# EAGLE design Nest (EAGLE 6.4)
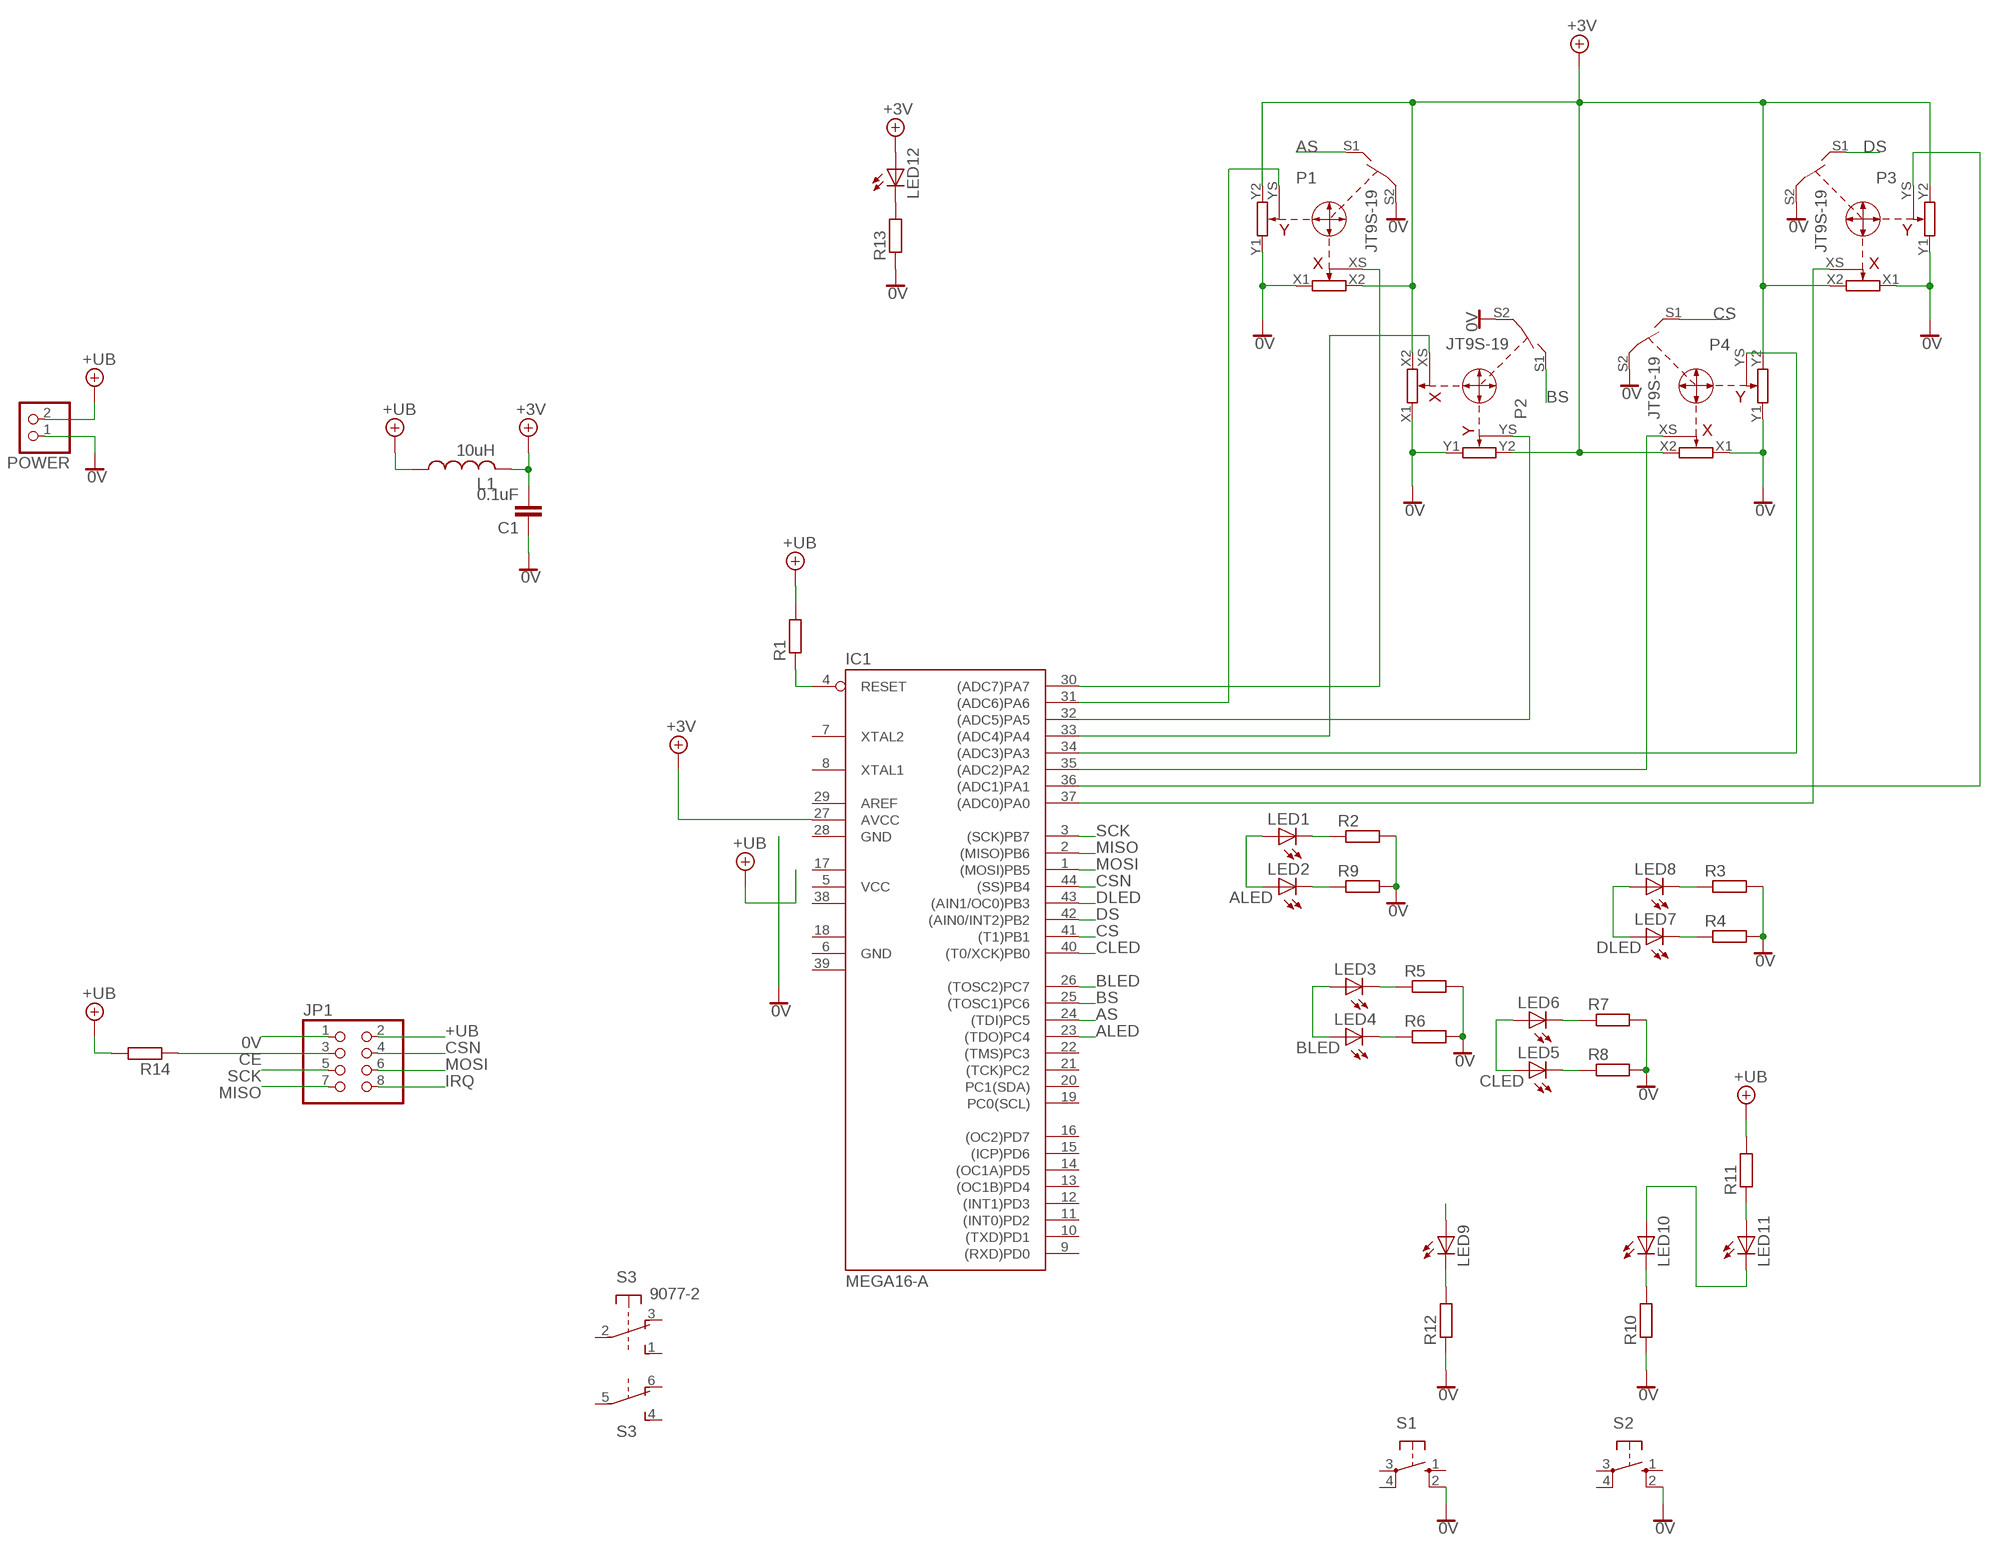
[diagram p0: schematic, sheet 1]

## Parts
C1  0.1uF  C-EU050-024X044  [C050-024X044]
IC1  MEGA16-A  [TQFP44]
JP1  PINHD-2X4  [2X04]
L1  10uH  L-US0204/7  [0204/7]
LED1  LED3MM  [LED3MM]
LED2  LED3MM  [LED3MM]
LED3  LED3MM  [LED3MM]
LED4  LED3MM  [LED3MM]
LED5  LED3MM  [LED3MM]
LED6  LED3MM  [LED3MM]
LED7  LED3MM  [LED3MM]
LED8  LED3MM  [LED3MM]
LED9  LED3MM  [LED3MM]
LED10  LED3MM  [LED3MM]
LED11  LED3MM  [LED3MM]
LED12  LED3MM  [LED3MM]
P1  JT9S-19  [JT9S-1P]
P2  JT9S-19  [JT9S-1P]
P3  JT9S-19  [JT9S-1P]
P4  JT9S-19  [JT9S-1P]
POWER  PINHD-1X2  [1X02]
R1  R-EU_R1206  [R1206]
R2  R-EU_M0805  [M0805]
R3  R-EU_M0805  [M0805]
R4  R-EU_M0805  [M0805]
R5  R-EU_M0805  [M0805]
R6  R-EU_M0805  [M0805]
R7  R-EU_M0805  [M0805]
R8  R-EU_M0805  [M0805]
R9  R-EU_M0805  [M0805]
R10  R-EU_M0805  [M0805]
R11  R-EU_M0805  [M0805]
R12  R-EU_M0805  [M0805]
R13  R-EU_M0805  [M0805]
R14  R-EU_R1206  [R1206]
S1  10-XX  [B3F-10XX]
S2  10-XX  [B3F-10XX]
S3  9077-2  [9077-2]

## Nets
0V: C1.1 JP1.1 P1.S2 P1.X1 P1.Y1 P2.S2 P2.X1 P2.Y1 P3.S2 P3.X1 P3.Y1 P4.S2 P4.X1 P4.Y1 POWER.1 R2.2 R3.2 R4.2 R5.2 R6.2 R7.2 R8.2 R9.2 R10.1 R12.1 R13.1 S1.2(S1) S2.2(S1)
+4.1V: C1.2 IC1.27(AVCC) L1.2 LED12.A P1.X2 P1.Y2 P2.X2 P2.Y2 P3.X2 P3.Y2 P4.X2 P4.Y2 ; supply symbol labelled +3V
+UB: JP1.2 L1.1 POWER.2 R1.2 R11.2 R14.2
ALED: IC1.23((TDO)PC4) LED1.A LED2.A
AS: IC1.24((TDI)PC5) P1.S1
BLED: IC1.26((TOSC2)PC7) LED3.A LED4.A
BS: IC1.25((TOSC1)PC6) P2.S1
CE: JP1.3 R14.1
CLED: IC1.40((T0/XCK)PB0) LED5.A LED6.A
CS: IC1.41((T1)PB1) P4.S1
CSN: IC1.44((SS)PB4) JP1.4
DLED: IC1.43((AIN1/OC0)PB3) LED7.A LED8.A
DS: IC1.42((AIN0/INT2)PB2) P3.S1
IRQ: JP1.8
MISO: IC1.2((MISO)PB6) JP1.7
MOSI: IC1.1((MOSI)PB5) JP1.6
N$1: LED1.K(C) R2.1
N$2: LED7.K(C) R4.1
N$3: IC1.4(RESET) R1.1
N$4: IC1.37((ADC0)PA0) P3.XS
N$6: IC1.31((ADC6)PA6) P1.YS
N$7: IC1.32((ADC5)PA5) P2.YS
N$8: IC1.33((ADC4)PA4) P2.XS
N$9: IC1.34((ADC3)PA3) P4.YS
N$10: IC1.35((ADC2)PA2) P4.XS
N$11: LED8.K(C) R3.1
N$12: IC1.36((ADC1)PA1) P3.YS
N$13: LED4.K(C) R6.1
N$14: LED3.K(C) R5.1
N$15: LED6.K(C) R7.1
N$16: LED5.K(C) R8.1
N$17: LED2.K(C) R9.1
N$22: LED10.A LED11.K(C)
N$23: LED11.A R11.1
N$24: LED10.K(C) R10.2
N$25: LED9.K(C) R12.2
N$26: LED12.K(C) R13.2
N$42: IC1.30((ADC7)PA7) P1.XS
N$58: LED9.A
SCK: IC1.3((SCK)PB7) JP1.5
Unconnected: IC1.7(XTAL2) IC1.8(XTAL1) IC1.9((RXD)PD0) IC1.10((TXD)PD1) IC1.11((INT0)PD2) IC1.12((INT1)PD3) IC1.13((OC1B)PD4) IC1.14((OC1A)PD5) IC1.15((ICP)PD6) IC1.16((OC2)PD7) IC1.19(PC0(SCL)) IC1.20(PC1(SDA)) IC1.21((TCK)PC2) IC1.22((TMS)PC3) IC1.29(AREF) S1.1(S) S1.3(P) S1.4(P1) S2.1(S) S2.3(P) S2.4(P1) S3.1(1:S) S3.2(1:P) S3.3(1:O) S3.4(2:S) S3.5(2:P) S3.6(2:O)

## Power pins joined to a net without a drawn wire
GND: IC1.6(GND) IC1.28(GND)
GND1: IC1.18(GND1)
GND2: IC1.39(GND2)
VCC: IC1.5(VCC)
VCC1: IC1.17(VCC1)
VCC2: IC1.38(VCC2)

## Library data of the parts
C1 = rcl:C-EU: CAPACITOR, European symbol
IC1 = atmel:MEGA16: MICROCONTROLLER 16 Kbytes FLASH 1 kbytes SRAM 512 bytes EEPROM USART 8-channel 10 bit ADC Source: avr.lbr; MPN: ATMEGA16-16AU; OC_FARNELL: 9171134; OC_NEWARK: 96K6515
JP1 = pinhead:PINHD-2X4: PIN HEADER
L1 = rcl:L-US: INDUCTOR, American symbol
LED1-LED12 = led:LED: LED OSRAM: - CHIPLED LG R971, LG N971, LY N971, LG Q971, LY Q971, LO R971, LY R971 LH N974, LH R974 LS Q976, LO Q976, LY Q976 LO Q996 - Hyper CHIPLED LW Q18S LB Q993, LB Q99A, LB R99A - SideLED LS A670, LO A670, LY A670, LG A670, LP A670 LB A673, LV A673, LT A673, LW A673 LH A674 LY A675 LS A676, LA A676, LO A676, LY A676, LW A676 LS A679, LY A679, LG A679 - Hyper Micro SIDELED® LS Y876, LA Y876, LO Y876, LY Y876 LT Y87S - SmartLED LW L88C, LW L88S LB L89C, LB L89S, LG L890 LS L89K, LO L89K, LY L89K LS L896, LA L896, LO L896, LY L896 - TOPLED LS T670, LO T670, LY T670, LG T670, LP T670 LSG T670, LSP T670, LSY T670, LOP T670, LYG T670 LG T671, LOG T671, LSG T671 LB T673, LV T673, LT T673, LW T673 LH T674 LS T676, LA T676, LO T676, LY T676, LB T676, LH T676, LSB T676, LW T676 LB T67C, LV T67C, LT T67C, LS T67K, LO T67K, LY T67K, LW E67C LS E67B, LA E67B, LO E67B, LY E67B, LB E67C, LV E67C, LT E67C LW T67C LS T679, LY T679, LG T679 LS T770, LO T770, LY T770, LG T770, LP T770 LB T773, LV T773, LT T773, LW T773 LH T774 LS E675, LA E675, LY E675, LS T675 LS T776, LA T776, LO T776, LY T776, LB T776 LHGB T686 LT T68C, LB T68C - Hyper Mini TOPLED® LB M676 - Mini TOPLED Santana® LG M470 LS M47K, LO M47K, LY M47K Source: http://www.osram.convergy.de LUXEON: - LUMILED® LXK2-PW12-R00, LXK2-PW12-S00, LXK2-PW14-U00, LXK2-PW14-V00 LXK2-PM12-R00, LXK2-PM12-S00, LXK2-PM14-U00 LXK2-PE12-Q00, LXK2-PE12-R00, LXK2-PE12-S00, LXK2-PE14-T00, LXK2-PE14-U00 LXK2-PB12-K00, LXK2-PB12-L00, LXK2-PB12-M00, LXK2-PB14-N00, LXK2-PB14-P00, LXK2-PB14-Q00 LXK2-PR12-L00, LXK2-PR12-M00, LXK2-PR14-Q00, LXK2-PR14-R00 LXK2-PD12-Q00, LXK2-PD12-R00, LXK2-PD12-S00 LXK2-PH12-R00, LXK2-PH12-S00 LXK2-PL12-P00, LXK2-PL12-Q00, LXK2-PL12-R00 Source: www.luxeon.com KINGBRIGHT: KA-3528ASYC Source: www.kingbright.com
P1-P4 = jt9s-1p:JT9S-19: Joystick Potentiometer 10k
POWER = pinhead:PINHD-1X2: PIN HEADER
R1-R14 = rcl:R-EU_: RESISTOR, European symbol
S1 S2 = switch-omron:10-XX: OMRON SWITCH; MPN: B3F-1000; OC_FARNELL: 176432; OC_NEWARK: 36M3542
S3 = switch-misc:9077-2: MARQUARDT SWITCH 9077.0200 Distributor: Buerklin <https://www.buerklin.com/default.asp?event=ShowArtikel%2812G2822%29&l=d&jump=ArtNr_12G2822>

## Board
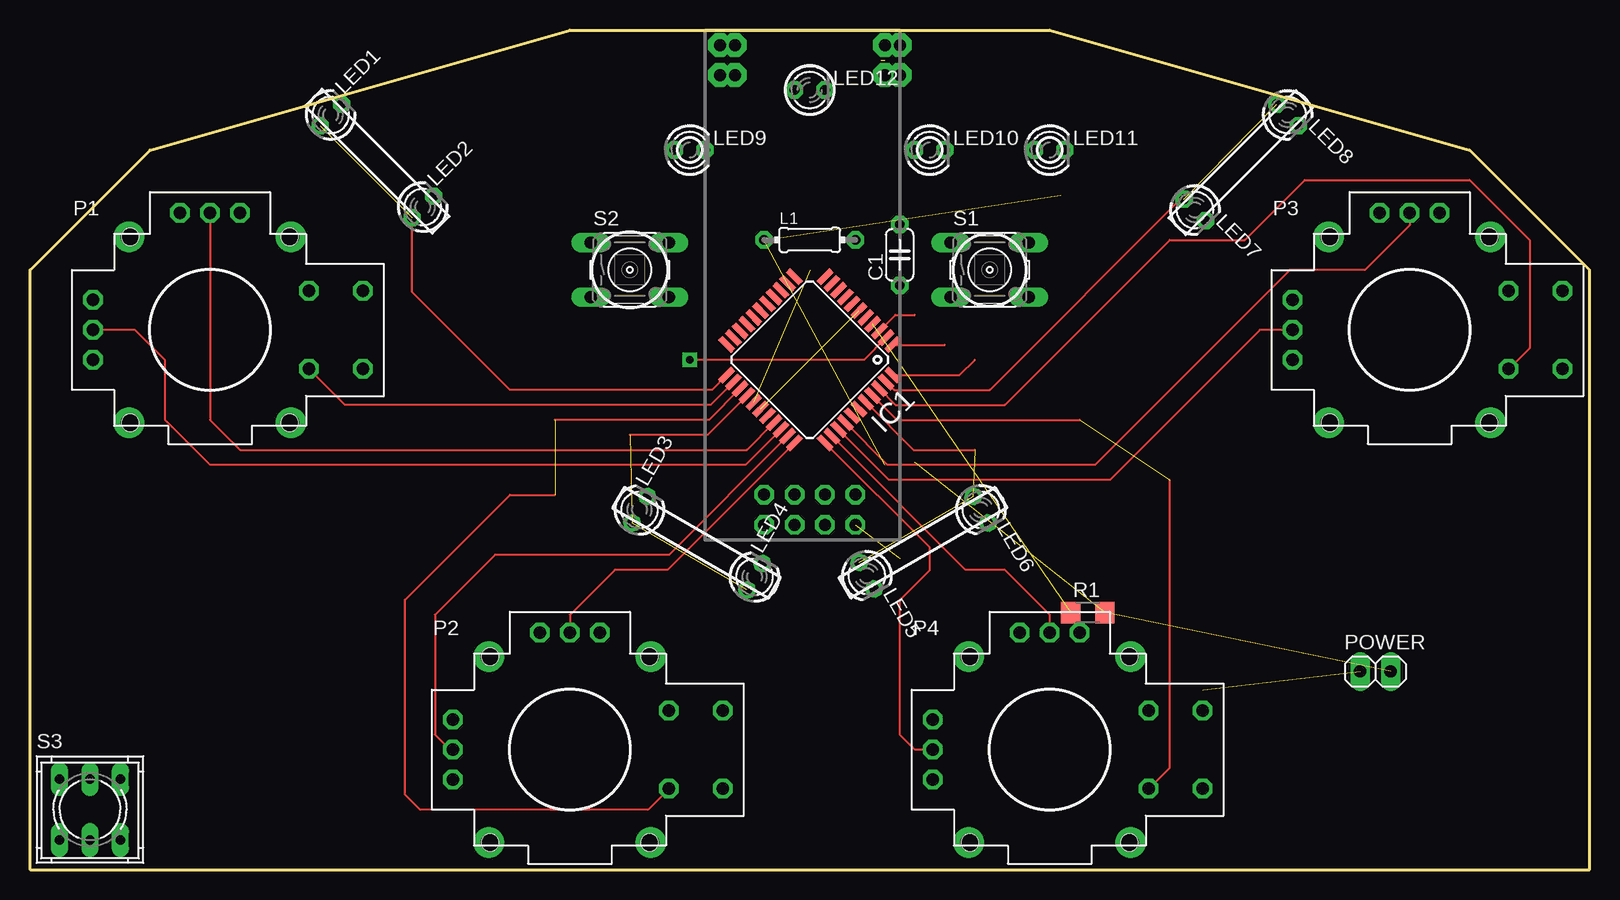
[diagram p1: board, top side]
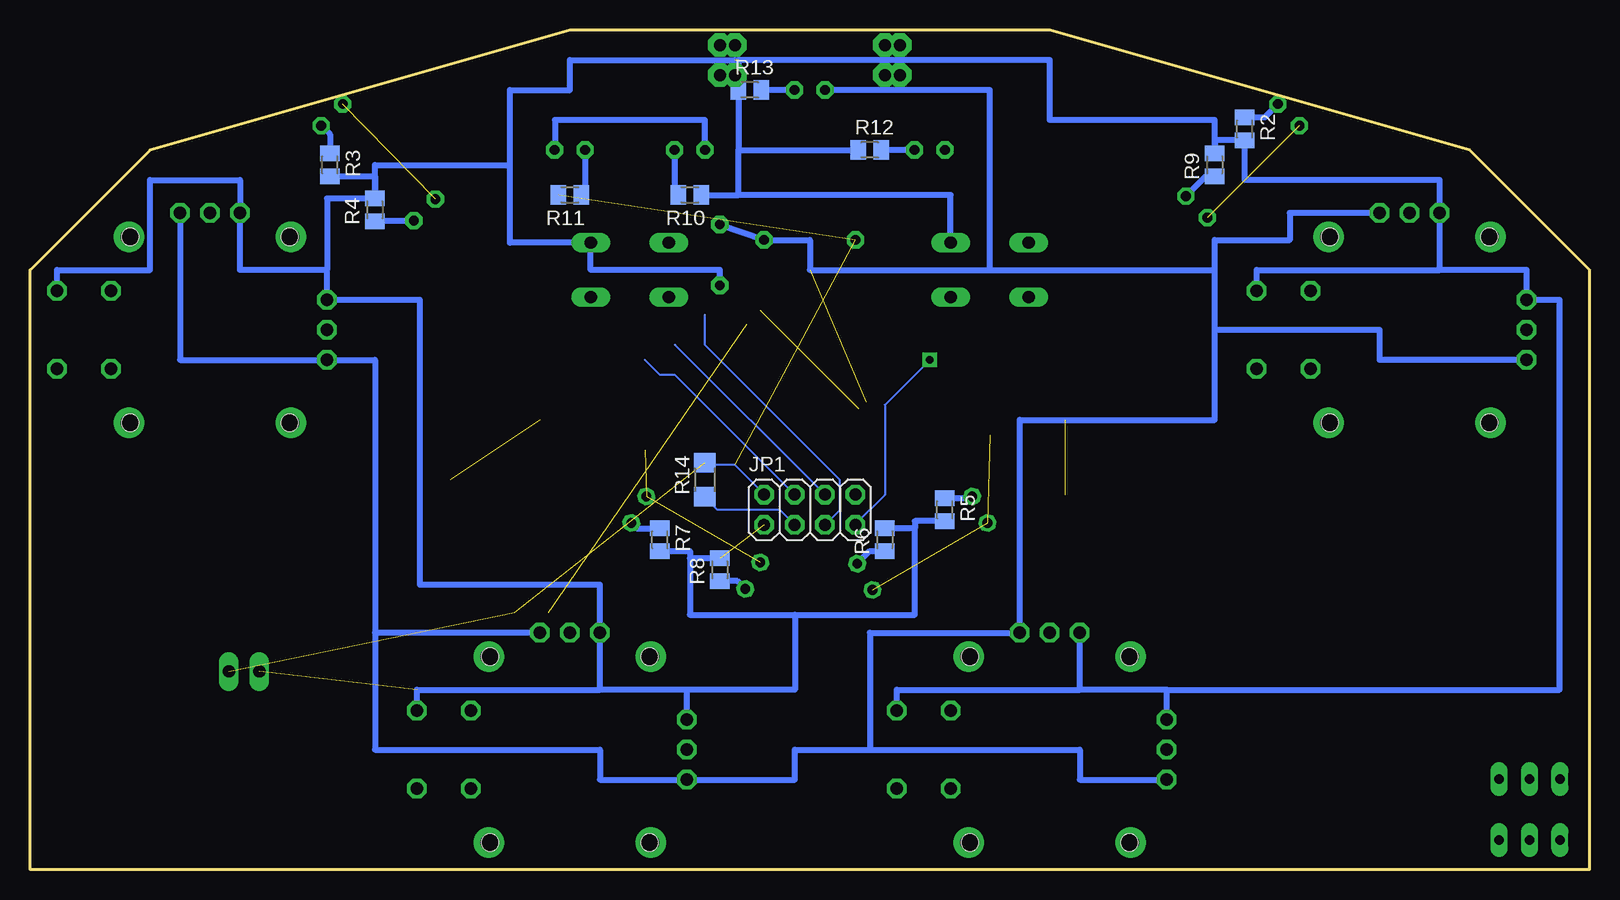
[diagram p2: board, bottom side, seen from below]

Size 130 x 70 mm. Coordinates in mm from the lower left corner, seen from the top.
Outline: 0,0 130,0 130,50 120,60 85,70 45,70 10,60 0,50 0,0
Copper layers (1*16): Top 0.035mm / dielectric 1.5mm / Bottom 0.035mm
Design rules "default": minimum track width 12mil, minimum drill 20mil, track to track 12mil, track to pad 12mil, pad to pad 12mil, via to via 12mil, smd to smd 12mil, copper to edge 40mil, drill to drill 40mil, minimum pad ring 12mil, minimum via ring 12mil, stop-mask expansion 8mil, vias tented up to drill 0mil, thermal gap 10mil

### Footprints (pad centres in the part's own frame; a part is rotated, then mirrored left to right if it is on the bottom)
C050-024X044 = drill 0.813 octagon: 1 -2.54,0; 2 2.54,0
TQFP44 = smd 1.5 x 0.5: 1 -5.8,4; 2 -5.8,3.2; 3 -5.8,2.4; 4 -5.8,1.6; 5 -5.8,0.8; 6 -5.8,0; 7 -5.8,-0.8; 8 -5.8,-1.6; 9 -5.8,-2.4; 10 -5.8,-3.2; 11 -5.8,-4; 23 5.8,-4; 24 5.8,-3.2; 25 5.8,-2.4; 26 5.8,-1.6; 27 5.8,-0.8; 28 5.8,0; 29 5.8,0.8; 30 5.8,1.6; 31 5.8,2.4; 32 5.8,3.2; 33 5.8,4 | smd 0.5 x 1.5: 12 -4,-5.8; 13 -3.2,-5.8; 14 -2.4,-5.8; 15 -1.6,-5.8; 16 -0.8,-5.8; 17 0,-5.8; 18 0.8,-5.8; 19 1.6,-5.8; 20 2.4,-5.8; 21 3.2,-5.8; 22 4,-5.8; 34 4,5.8; 35 3.2,5.8; 36 2.4,5.8; 37 1.6,5.8; 38 0.8,5.8; 39 0,5.8; 40 -0.8,5.8; 41 -1.6,5.8; 42 -2.4,5.8; 43 -3.2,5.8; 44 -4,5.8
2X04 = drill 1.016 octagon: 1 -3.81,-1.27; 2 -3.81,1.27; 3 -1.27,-1.27; 4 -1.27,1.27; 5 1.27,-1.27; 6 1.27,1.27; 7 3.81,-1.27; 8 3.81,1.27
0204/7 = drill 0.813 octagon: 1 -3.81,0; 2 3.81,0
LED3MM = drill 0.813 octagon: A -1.27,0; K 1.27,0
JT9S-1P = drill 1.016 octagon: S1 8.25,-3.25; S2 12.75,3.25; S3 12.75,-3.25; S4 8.25,3.25; X1 -2.5,9.75; X2 2.5,9.75; XS 0,9.75; Y1 -9.75,2.5; Y2 -9.75,-2.5; YS -9.75,0 | hole 1.422: -6.65,7.75; 6.65,7.75; 6.65,-7.75; -6.65,-7.75
1X02 = drill 1.016 long: 1 -1.27,0; 2 1.27,0
R1206 = smd 1.6 x 1.803: 1 -1.422,0; 2 1.422,0
M0805 = smd 1.3 x 1.6: 1 -0.95,0; 2 0.95,0
B3F-10XX = drill 1.016 long: 1 -3.251,2.261; 2 3.251,2.261; 3 -3.251,-2.261; 4 3.251,-2.261
9077-2 = drill 0.813 long: 1 -2.54,2.54; 2 0,2.54; 3 2.54,2.54; 4 -2.54,-2.54; 5 0,-2.54; 6 2.54,-2.54

### Placement (x,y rotation side)
C1  72.5,51.25 90 top
IC1  65,42.5 225 top
JP1  65,30 0 bottom
L1  65,52.5 0 top
LED1  25.07,62.93 45 top
LED2  32.75,55.25 45 top
LED3  50.82,30 60 top
LED4  60.41,24.41 60 top
LED5  69.75,24.5 300 top
LED6  79.25,30 300 top
LED7  97.1,55 315 top
LED8  104.82,62.93 315 top
LED9  55,60 0 top
LED10  75,60 0 top
LED11  85,60 0 top
LED12  65,65 0 top
P1  15,45 0 top
P2  45,10 0 top
P3  115,45 0 top
P4  85,10 0 top
POWER  112.15,16.51 0 top
R1  88.18,21.43 0 top
R2  28.75,61.75 270 bottom
R3  105,58.75 270 bottom
R4  101.25,55 90 bottom
R5  53.75,30 270 bottom
R6  58.75,27.5 90 bottom
R7  77.5,27.5 270 bottom
R8  72.5,25 90 bottom
R9  31.25,58.75 90 bottom
R10  75,56.25 180 bottom
R11  85,56.25 180 bottom
R12  60,60 0 bottom
R13  70,65 0 bottom
R14  73.75,32.5 90 bottom
S1  80,50 0 top
S2  50,50 0 top
S3  5,5 0 top

### Tracks (layer width: path | path; a pad name or v marks a point on that pad's centre or on a via)
0V  (3 unrouted)
  Bottom 0.5: P2.S2 57.75,15 42.5,15 | 42.5,15 P2.X1 | P2.Y1 35.25,15 | 35.25,15 42.5,15 | P4.Y1 75.25,15 | 75.25,15 82.5,15 | 82.5,15 P4.X1 82.5,23.75 97.5,23.75 97.5,47.5 P3.Y1 105.25,50 | P4.S2 97.75,15 82.5,15 | P1.S2 27.75,50 12.5,50 | 12.5,50 P1.X1 12.5,57.5 28.75,57.5 R2.2 31.25,60.8 R9.2 31.25,62.5 45,62.5 45,67.5 70.95,67.5 R13.1 70.95,60 | 12.5,50 5.25,50 P1.Y1 2.5,47.5 2.5,15 35.25,15 | 105.25,50 112.5,50 P3.X1 112.5,57.5 120,57.5 120,50 127.75,50 P3.S2 | 70.95,60 R12.1 | R10.1 70.95,56.25 | 70.95,56.25 70.95,60 | R3.2 101.25,57.8 R4.2 | R4.2 101.25,58.75 90,58.75 | 90,58.75 90,65 85,65 85,67.5 71.25,67.5 | R4.2 105.25,55.95 105.25,50 | S2.2 53.25,56.25 70.95,56.25 | 90,58.75 90,52.26 S1.2 83.25,50 72.5,50 C1.1 | R5.2 56.25,29.05 56.25,28.45 | 56.25,28.45 R6.2 | R8.2 75,25.95 | 75,25.95 75,21.25 66.25,21.25 | 66.25,21.25 56.25,21.25 56.25,28.45 | R7.2 75,26.55 75,25.95 | 66.25,21.25 66.25,15 75.25,15
+4.1V  (1 unrouted)
  Bottom 0.5: C1.2 68.81,52.54 L1.2 65,52.5 65,50 50,50 | 50,50 50,65 LED12.A | P1.Y2 17.5,42.5 17.5,45 31.25,45 | 31.25,45 31.25,50 | 31.25,50 31.25,52.5 25,52.5 25,54.75 P1.X2 | 50,50 31.25,50 | P3.X2 117.5,42.5 P3.Y2 101.25,42.5 101.25,19.75 | P4.X2 101.25,19.75 | 101.25,19.75 101.25,10 82.5,10 82.5,7.5 P4.Y2 66.25,7.5 66.25,10 60,10 | 60,10 60,19.75 P2.X2 47.5,37.5 31.25,37.5 31.25,45 | 60,10 42.5,10 42.5,7.5 P2.Y2
+UB  (4 unrouted)
  Bottom 0.15: JP1.2 68.81,31.31 71.25,33.75 73.58,33.75 R14.2
ALED  (1 unrouted)
  Top 0.15: IC1.23 56.84,40 40,40 31.85,48.15 LED2.A
AS
  Top 0.15: IC1.24 56.73,38.75 26.25,38.75 P1.S1
BLED  (2 unrouted)
  Top 0.15: IC1.26 56.49,36.25 50,36.25
BS  (1 unrouted)
  Top 0.15: IC1.25 56.61,37.5 43.75,37.5 | P2.S1 51.5,5 32.5,5 31.25,6.25 31.25,22.5 40,31.25 43.75,31.25
CE
  Bottom 0.15: JP1.3 66.27,28.77 67.5,30 72.67,30 R14.1
CLED  (2 unrouted)
  Top 0.15: IC1.40 73.63,35 78.75,35
CS  (1 unrouted)
  Top 0.15: P4.S1 95,8.5 95,32.5 | IC1.41 72.26,37.5 87.5,37.5
CSN  (1 unrouted)
  Top 0.15: IC1.44 77.48,41.23 78.75,42.5
  Bottom 0.15: JP1.4 76.25,41.25 77.5,41.25 78.75,42.5
DLED  (1 unrouted)
  Top 0.15: IC1.43 72.03,40 80,40 95.9,55.9 LED7.A
DS
  Top 0.15: IC1.42 72.14,38.75 81.25,38.75 95,52.5 101.25,52.5 106.25,57.5 120,57.5 125,52.5 125,43.5 P3.S1
GND  (1 unrouted)
MISO  (via drill 0.6)
  Top 0.15: IC1.2 69.53,42.5 v55,42.5
  Bottom 0.15: v55,42.5 58.75,38.75 58.75,31.25 61.19,28.81 JP1.7
MOSI  (1 unrouted)
  Top 0.15: IC1.1 71.95,43.75 76.25,43.75
  Bottom 0.15: JP1.6 76.21,43.75 76.25,43.75
N$1
  Bottom 0.5: LED1.K 27.1,62.7 R2.1
N$2
  Bottom 0.5: LED7.K 98.05,54.05 R4.1
N$3  (1 unrouted)
N$4
  Top 0.15: P3.XS 115,53.75 111.25,50 105,50 88.75,33.75 71.49,33.75 IC1.37
N$6
  Top 0.15: IC1.31 59.64,33.75 15,33.75 11.25,37.5 11.25,42.5 8.75,45 P1.YS
N$7
  Top 0.15: IC1.32 53.27,26.25 38.75,26.25 33.75,21.25 33.75,11.25 35,10 P2.YS
N$8
  Top 0.15: IC1.33 53.16,25 48.75,25 45,21.25 P2.XS
N$9
  Top 0.15: P4.YS 73.75,10 72.5,11.25 72.5,22.5 75,25 75,26.84 IC1.34
N$10
  Top 0.15: P4.XS 85,21.25 81.25,25 77.97,25 IC1.35
N$11
  Bottom 0.5: LED8.K 105,61.31 R3.1
N$12
  Top 0.15: P3.YS 102.5,45 90,32.5 71.61,32.5 IC1.36
N$13
  Bottom 0.5: LED4.K 60,26.55 R6.1
N$14
  Bottom 0.5: LED3.K 51.6,30.95 R5.1
N$15
  Bottom 0.5: LED6.K 79.44,28.45 R7.1
N$16
  Bottom 0.5: LED5.K 71.03,24.05 R8.1
N$17
  Bottom 0.5: LED2.K 32,57.8 R9.1
N$18  (via drill 1.4 pad 2.54)
  other vias: 8.25,52.75
N$19  (via drill 1.4 pad 2.54)
  other vias: 21.75,52.75
N$20  (via drill 1.4 pad 2.54)
  other vias: 21.75,37.25
N$21  (via drill 1.4 pad 2.54)
  other vias: 8.25,37.25
N$22
  Bottom 0.5: LED10.A 73.75,60 73.75,62.5 86.25,62.5 86.25,60 LED11.K
N$23
  Bottom 0.5: LED11.A 83.73,56.25 R11.1
N$24
  Bottom 0.5: LED10.K 76.27,56.25 R10.2
N$25
  Bottom 0.5: LED9.K R12.2
N$26
  Bottom 0.5: LED12.K R13.2
N$27  (via drill 1.4 pad 2.54)
  other vias: 108.25,52.75
N$28  (via drill 1.4 pad 2.54)
  other vias: 121.75,52.75
N$29  (via drill 1.4 pad 2.54)
  other vias: 121.75,37.25
N$30  (via drill 1.4 pad 2.54)
  other vias: 108.25,37.25
N$31  (via drill 1.4 pad 2.54)
  other vias: 91.75,17.75
N$32  (via drill 1.4 pad 2.54)
  other vias: 78.25,17.75
N$33  (via drill 1.4 pad 2.54)
  other vias: 78.25,2.25
N$34  (via drill 1.4 pad 2.54)
  other vias: 91.75,2.25
N$35  (via drill 1.4 pad 2.54)
  other vias: 38.25,2.25
N$36  (via drill 1.4 pad 2.54)
  other vias: 51.75,2.25
N$37  (via drill 1.4 pad 2.54)
  other vias: 51.75,17.75
N$38  (via drill 1.4 pad 2.54)
  other vias: 38.25,17.75
N$39  (via drill 1 pad 1.93)
  other vias: 71.25,68.75
N$40  (via drill 1 pad 1.93)
  other vias: 71.25,66.25
N$42
  Top 0.15: P1.XS 15,37.5 17.5,35 59.76,35 IC1.30
N$48  (via drill 1 pad 1.93)
  other vias: 57.5,68.75
N$49  (via drill 1 pad 1.93)
  other vias: 57.5,66.25
N$50  (via drill 1 pad 1.93)
  other vias: 72.5,68.75
N$51  (via drill 1 pad 1.93)
  other vias: 72.5,66.25
N$52  (via drill 1 pad 1.93)
  other vias: 58.75,66.25
N$53  (via drill 1 pad 1.93)
  other vias: 58.75,68.75
SCK  (1 unrouted)
  Top 0.15: IC1.3 72.14,46.25 73.75,46.25
  Bottom 0.15: JP1.5 62.5,29.96 62.5,32.5 73.75,43.75 73.75,46.25